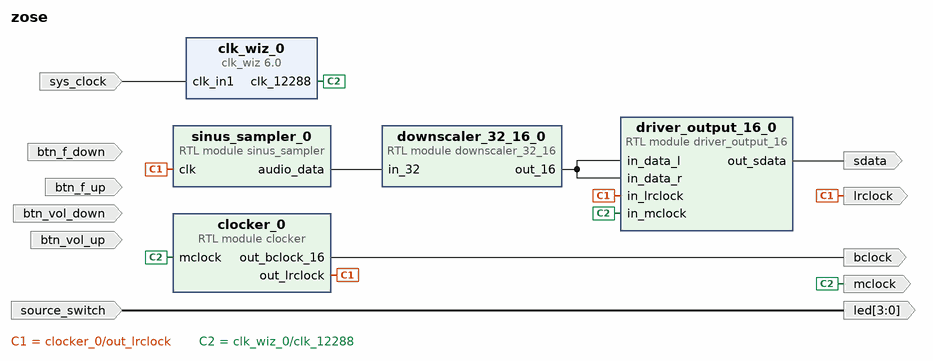
[diagram p0: block diagram of the top level]
# Vivado block design zose, xc7a35ticsg324-1L, Vivado 2018.1
create_bd_design zose

create_bd_port -dir I btn_vol_down
create_bd_port -dir I btn_vol_up
create_bd_port -dir I btn_f_down
create_bd_port -dir I btn_f_up
create_bd_port -dir I -type clk sys_clock
set_property -dict {CONFIG.FREQ_HZ 100000000 CONFIG.PHASE 0.000} [get_bd_ports sys_clock]
create_bd_port -dir O -type clk lrclock
create_bd_port -dir I source_switch
create_bd_port -dir O -from 3 -to 0 -type data led
create_bd_port -dir O -type clk bclock
create_bd_port -dir O -type data sdata
create_bd_port -dir O -type clk mclock

create_bd_cell -type ip -vlnv xilinx.com:ip:clk_wiz:6.0 clk_wiz_0
set_property -dict [list \
  CONFIG.ENABLE_CLOCK_MONITOR false \
  CONFIG.PRIMITIVE MMCM \
  CONFIG.USE_SPREAD_SPECTRUM false \
  CONFIG.JITTER_SEL Min_O_Jitter \
  CONFIG.CLKOUT1_USED true \
  CONFIG.CLKOUT2_USED true \
  CONFIG.CLKOUT3_USED true \
  CONFIG.CLKOUT4_USED false \
  CONFIG.CLKOUT5_USED false \
  CONFIG.NUM_OUT_CLKS 3 \
  CONFIG.CLK_OUT1_PORT clk_24586 \
  CONFIG.CLK_OUT2_PORT clk_12288 \
  CONFIG.CLK_OUT3_PORT clk_49154 \
  CONFIG.CLKOUT1_REQUESTED_OUT_FREQ 24.576 \
  CONFIG.CLKOUT1_REQUESTED_DUTY_CYCLE 50.0 \
  CONFIG.CLKOUT2_REQUESTED_OUT_FREQ 12.288 \
  CONFIG.CLKOUT2_REQUESTED_DUTY_CYCLE 50.0 \
  CONFIG.CLKOUT3_REQUESTED_OUT_FREQ 49.154 \
  CONFIG.CLKOUT3_REQUESTED_DUTY_CYCLE 50.0 \
  CONFIG.CLKOUT4_REQUESTED_DUTY_CYCLE 50.000 \
  CONFIG.CLKOUT5_REQUESTED_DUTY_CYCLE 50.000 \
  CONFIG.CLKOUT1_DRIVES BUFG \
  CONFIG.CLKOUT2_DRIVES BUFG \
  CONFIG.CLKOUT3_DRIVES BUFG \
  CONFIG.CLKOUT4_DRIVES BUFG \
  CONFIG.CLKOUT5_DRIVES BUFG \
  CONFIG.CLKOUT6_DRIVES BUFG \
  CONFIG.CLKOUT7_DRIVES BUFG \
  CONFIG.FEEDBACK_SOURCE FDBK_AUTO \
  CONFIG.USE_LOCKED false \
  CONFIG.USE_RESET false \
  CONFIG.RESET_PORT resetn \
  CONFIG.MMCM_DIVCLK_DIVIDE 2 \
  CONFIG.MMCM_BANDWIDTH HIGH \
  CONFIG.MMCM_CLKFBOUT_MULT_F 21.625 \
  CONFIG.MMCM_CLKIN1_PERIOD 10.000 \
  CONFIG.MMCM_CLKIN2_PERIOD 10.000 \
  CONFIG.MMCM_COMPENSATION ZHOLD \
  CONFIG.MMCM_CLKOUT0_DIVIDE_F 44.000 \
  CONFIG.MMCM_CLKOUT0_DUTY_CYCLE 0.500 \
  CONFIG.MMCM_CLKOUT1_DIVIDE 88 \
  CONFIG.MMCM_CLKOUT2_DIVIDE 22 \
  CONFIG.MMCM_CLKOUT4_DIVIDE 1 \
  CONFIG.RESET_TYPE ACTIVE_LOW \
  CONFIG.CLKOUT1_JITTER 205.775 \
  CONFIG.CLKOUT1_PHASE_ERROR 159.389 \
  CONFIG.CLKOUT2_JITTER 238.466 \
  CONFIG.CLKOUT2_PHASE_ERROR 159.389 \
  CONFIG.CLKOUT3_JITTER 172.900 \
  CONFIG.CLKOUT3_PHASE_ERROR 159.389 \
  CONFIG.CLKOUT4_JITTER 162.650 \
  CONFIG.CLKOUT4_PHASE_ERROR 700.288 \
  CONFIG.CLKOUT5_JITTER 229.222 \
  CONFIG.CLKOUT5_PHASE_ERROR 700.288 \
] [get_bd_cells clk_wiz_0]
create_bd_cell -type module -reference downscaler_32_16 downscaler_32_16_0
create_bd_cell -type module -reference driver_output_16 driver_output_16_0
create_bd_cell -type module -reference clocker clocker_0
create_bd_cell -type module -reference sinus_sampler sinus_sampler_0

# ---- connections ----

connect_bd_net [get_bd_ports sys_clock] [get_bd_pins clk_wiz_0/clk_in1]
connect_bd_net [get_bd_pins clocker_0/out_lrclock] \
  [get_bd_ports lrclock] [get_bd_pins driver_output_16_0/in_lrclock] [get_bd_pins sinus_sampler_0/clk]
connect_bd_net [get_bd_ports source_switch] [get_bd_ports led]
connect_bd_net [get_bd_pins clocker_0/out_bclock_16] [get_bd_ports bclock]
connect_bd_net [get_bd_pins driver_output_16_0/out_sdata] [get_bd_ports sdata]
connect_bd_net [get_bd_pins downscaler_32_16_0/out_16] [get_bd_pins driver_output_16_0/in_data_l] [get_bd_pins driver_output_16_0/in_data_r]
connect_bd_net [get_bd_pins sinus_sampler_0/audio_data] [get_bd_pins downscaler_32_16_0/in_32]
connect_bd_net [get_bd_pins clk_wiz_0/clk_12288] [get_bd_ports mclock] [get_bd_pins driver_output_16_0/in_mclock] [get_bd_pins clocker_0/mclock]

validate_bd_design
save_bd_design
